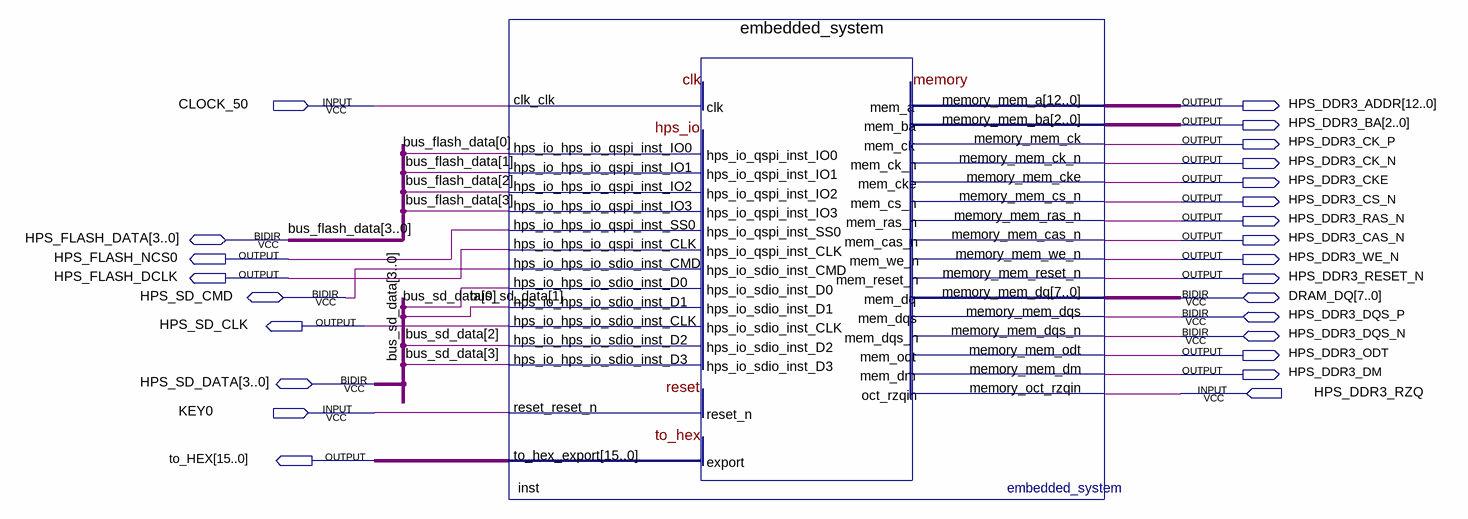
[diagram p0: schematic sheet]
// Quartus schematic top_bak.bdf as structural Verilog: 1 symbols, 25 pins
module top_bak (
  input  CLOCK_50,
  input  HPS_DDR3_RZQ,
  input  KEY0,
  inout  [3:0] HPS_FLASH_DATA,
  inout  HPS_SD_CMD,
  inout  [7:0] DRAM_DQ,
  inout  HPS_DDR3_DQS_P,
  inout  HPS_DDR3_DQS_N,
  inout  [3:0] HPS_SD_DATA,
  output [12:0] HPS_DDR3_ADDR,
  output [2:0] HPS_DDR3_BA,
  output HPS_DDR3_CK_P,
  output HPS_DDR3_CK_N,
  output HPS_DDR3_CKE,
  output HPS_DDR3_CS_N,
  output HPS_DDR3_RAS_N,
  output HPS_DDR3_CAS_N,
  output HPS_FLASH_NCS0,
  output HPS_DDR3_WE_N,
  output HPS_FLASH_DCLK,
  output HPS_DDR3_RESET_N,
  output HPS_SD_CLK,
  output HPS_DDR3_ODT,
  output HPS_DDR3_DM,
  output [15:0] to_HEX
);

  embedded_system inst (
    .clk_clk(CLOCK_50), .memory_oct_rzqin(HPS_DDR3_RZQ), .reset_reset_n(KEY0),
    .hps_io_hps_io_qspi_inst_SS0(HPS_FLASH_NCS0), .hps_io_hps_io_qspi_inst_CLK(HPS_FLASH_DCLK),
    .hps_io_hps_io_sdio_inst_CLK(HPS_SD_CLK), .memory_mem_a(HPS_DDR3_ADDR), .memory_mem_ba(HPS_DDR3_BA),
    .memory_mem_ck(HPS_DDR3_CK_P), .memory_mem_ck_n(HPS_DDR3_CK_N), .memory_mem_cke(HPS_DDR3_CKE),
    .memory_mem_cs_n(HPS_DDR3_CS_N), .memory_mem_ras_n(HPS_DDR3_RAS_N), .memory_mem_cas_n(HPS_DDR3_CAS_N),
    .memory_mem_we_n(HPS_DDR3_WE_N), .memory_mem_reset_n(HPS_DDR3_RESET_N), .memory_mem_odt(HPS_DDR3_ODT),
    .memory_mem_dm(HPS_DDR3_DM), .to_hex_export(to_HEX), .hps_io_hps_io_qspi_inst_IO0(HPS_FLASH_DATA[0]),
    .hps_io_hps_io_qspi_inst_IO1(HPS_FLASH_DATA[1]), .hps_io_hps_io_qspi_inst_IO2(HPS_FLASH_DATA[2]),
    .hps_io_hps_io_qspi_inst_IO3(HPS_FLASH_DATA[3]), .hps_io_hps_io_sdio_inst_CMD(HPS_SD_CMD),
    .hps_io_hps_io_sdio_inst_D0(HPS_SD_DATA[0]), .hps_io_hps_io_sdio_inst_D1(HPS_SD_DATA[1]),
    .hps_io_hps_io_sdio_inst_D2(HPS_SD_DATA[2]), .hps_io_hps_io_sdio_inst_D3(HPS_SD_DATA[3]),
    .memory_mem_dq(DRAM_DQ), .memory_mem_dqs(HPS_DDR3_DQS_P), .memory_mem_dqs_n(HPS_DDR3_DQS_N));

  // Other names for the same wires on the sheet: bus_flash_data[3:0] = HPS_FLASH_DATA; bus_sd_data[3:0] = HPS_SD_DATA
endmodule
